# Altium schematic sheet disp7segTester.SchDoc: DE:TMP:11:UC:EXPANDIDO
size 386 x 254 mm; Date: 21-07-2022; SheetNumber: 1; SheetTotal: 1; WebFGR: www.abebashop.com; VersionFGR: 20220721; PageSetup: Record=PageOptions|CenterHorizontal=True|CenterVertical=True|PrintScale=0.74|XCorrection=1.00|YCorrection=1.00|PrintKind=0|BorderSize=5000000|LeftOffset=0|BottomOffset=0|Orientation=2|PaperLength=1000|PaperWidth=1000|Scale=100|PaperSource=7|PrintQuality=-4|MediaType=1|DitherType=10|PaperKind=Letter|PrintScaleMode=1
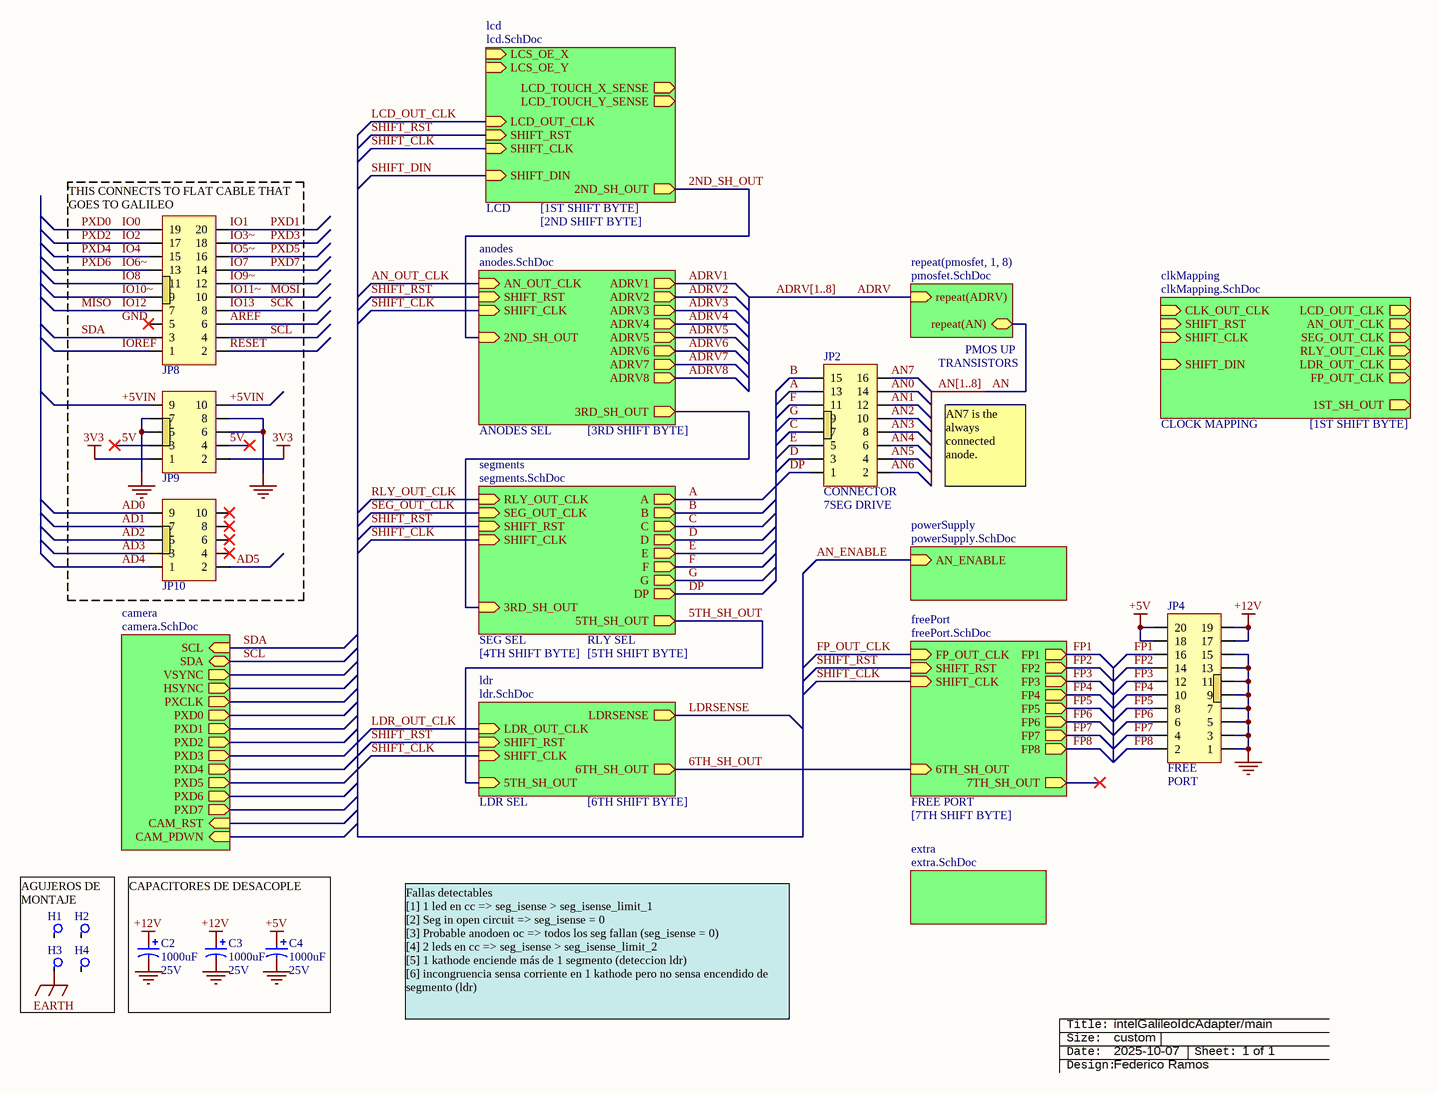
[diagram p0: disp7segTester.SchDoc]

## Parts
C2  value 1000uF  Voltaje: 25V  [C_EL_6-3X11]  (hidden comment: Cap Pol)
C3  value 1000uF  Voltaje: 25V  [C_EL_6-3X11]  (hidden comment: Cap Pol)
C4  value 1000uF  Voltaje: 25V  [C_EL_6-3X11]  (hidden comment: Cap Pol)
H1  Agujero de montaje  [agujero]  (value not drawn)
H2  Agujero de montaje  [agujero]  (value not drawn)
H3  Agujero de montaje  [agujero]  (value not drawn)
H4  Agujero de montaje  [agujero]  (value not drawn)
JP2  con: CONNECTOR  [idc8x2_90]  (hidden comment: IDC 8x2 90deg)
JP4  IDC 10x2  [idc10x2]  (value not drawn)
JP8  IDC 10x2 90deg  [idc10x2_90]  (value not drawn)
JP9  IDC 5x2  [IDC5x2_90]  (value not drawn)
JP10  IDC 5x2  [IDC5x2_90]  (value not drawn)
ROT?  Rotulo_empty  (value not drawn)  (graphical)

## Sub-sheets
anodes = anodes.SchDoc: 3RD_SH_OUT (out), AN_OUT_CLK (in), SHIFT_RST (in), SHIFT_CLK (in), 2ND_SH_OUT (in), ADRV1 (out), ADRV2 (out), ADRV3 (out), ADRV4 (out), ADRV5 (out), ADRV6 (out), ADRV7 (out), ADRV8 (out)  | : [3RD SHIFT BYTE]; : ANODES SEL
camera = camera.SchDoc: SCL (in), SDA (bidir), VSYNC (out), HSYNC (out), PXD0 (out), PXD1 (out), PXD2 (out), PXD3 (out), PXD4 (out), PXD5 (out), PXD6 (out), PXD7 (out), CAM_RST (in), CAM_PDWN (in), PXCLK (out)
clkMapping = clkMapping.SchDoc: 1ST_SH_OUT (out), CLK_OUT_CLK (in), SHIFT_RST (in), SHIFT_CLK (in), SHIFT_DIN (in), LCD_OUT_CLK (out), AN_OUT_CLK (out), SEG_OUT_CLK (out), RLY_OUT_CLK (out), LDR_OUT_CLK (out), FP_OUT_CLK (out)  | : [1ST SHIFT BYTE]; : CLOCK MAPPING
extra = extra.SchDoc: no entries
freePort = freePort.SchDoc: 7TH_SH_OUT (out), FP_OUT_CLK (in), SHIFT_RST (in), SHIFT_CLK (in), 6TH_SH_OUT (in), FP1 (out), FP2 (out), FP3 (out), FP4 (out), FP5 (out), FP6 (out), FP7 (out), FP8 (out)  | : [7TH SHIFT BYTE]; : FREE PORT
lcd = lcd.SchDoc: LCD_OUT_CLK (in), SHIFT_RST (in), SHIFT_CLK (in), SHIFT_DIN (in), 2ND_SH_OUT (out), LCS_OE_Y (in), LCS_OE_X (in), LCD_TOUCH_X_SENSE (out), LCD_TOUCH_Y_SENSE (out)  | : LCD; : [1ST SHIFT BYTE]; : [2ND SHIFT BYTE]
ldr = ldr.SchDoc: LDRSENSE (out), LDR_OUT_CLK (in), SHIFT_RST (in), SHIFT_CLK (in), 5TH_SH_OUT (in), 6TH_SH_OUT (out)  | : [6TH SHIFT BYTE]; : LDR SEL
powerSupply = powerSupply.SchDoc: AN_ENABLE (in)
repeat(pmosfet, 1, 8) = pmosfet.SchDoc: repeat(AN), repeat(ADRV) (in)  | : TRANSISTORS; : PMOS UP
segments = segments.SchDoc: 5TH_SH_OUT (out), RLY_OUT_CLK (in), SEG_OUT_CLK (in), SHIFT_RST (in), SHIFT_CLK (in), 3RD_SH_OUT (in), A (out), B (out), C (out), D (out), E (out), F (out), G (out), DP (out)  | : [5TH SHIFT BYTE]; : SEG SEL; : RLY SEL; : [4TH SHIFT BYTE]

## Nets
3V3: JP9.1 JP9.2
+5V: C4.1 JP4.18 JP4.20
+12V: C2.1 C3.1 JP4.17 JP4.19
EARTH: H3.1
GND: C2.2 C3.2 C4.2 JP4.1 JP4.3 JP4.5 JP4.7 JP4.9 JP4.11 JP4.13 JP4.15 JP9.5 JP9.6 JP9.7 JP9.8
2ND_SH_OUT: sheet anodes/2ND_SH_OUT, sheet lcd/2ND_SH_OUT
5TH_SH_OUT: sheet ldr/5TH_SH_OUT, sheet segments/5TH_SH_OUT
5V: JP9.3 JP9.4
6TH_SH_OUT: sheet ldr/6TH_SH_OUT, sheet freePort/6TH_SH_OUT
+5VIN: JP9.9 JP9.10
A: JP2.13 ; sheet segments/A
AD0: JP10.9
AD1: JP10.7
AD2: JP10.5
AD3: JP10.3
AD4: JP10.1
AD5: JP10.2
ADRV: sheet repeat(pmosfet, 1, 8)/repeat(ADRV)
ADRV1: sheet anodes/ADRV1
ADRV2: sheet anodes/ADRV2
ADRV3: sheet anodes/ADRV3
ADRV4: sheet anodes/ADRV4
ADRV5: sheet anodes/ADRV5
ADRV6: sheet anodes/ADRV6
ADRV7: sheet anodes/ADRV7
ADRV8: sheet anodes/ADRV8
AN: sheet repeat(pmosfet, 1, 8)/repeat(AN)
AN0: JP2.14
AN1: JP2.12
AN2: JP2.10
AN3: JP2.8
AN4: JP2.6
AN5: JP2.4
AN6: JP2.2
AN7: JP2.16
AN_ENABLE: sheet powerSupply/AN_ENABLE
AN_OUT_CLK: sheet anodes/AN_OUT_CLK
AREF: JP8.6
B: JP2.15 ; sheet segments/B
C: JP2.7 ; sheet segments/C
D: JP2.3 ; sheet segments/D
DP: JP2.1 ; sheet segments/DP
E: JP2.5 ; sheet segments/E
F: JP2.11 ; sheet segments/F
FP1: JP4.16 ; sheet freePort/FP1
FP2: JP4.14 ; sheet freePort/FP2
FP3: JP4.12 ; sheet freePort/FP3
FP4: JP4.10 ; sheet freePort/FP4
FP5: JP4.8 ; sheet freePort/FP5
FP6: JP4.6 ; sheet freePort/FP6
FP7: JP4.4 ; sheet freePort/FP7
FP8: JP4.2 ; sheet freePort/FP8
FP_OUT_CLK: sheet freePort/FP_OUT_CLK
G: JP2.9 ; sheet segments/G
IO0: JP8.19  [also labelled PXD0]
IO1: JP8.20  [also labelled PXD1]
IO2: JP8.17  [also labelled PXD2]
IO3~: JP8.18  [also labelled PXD3]
IO4: JP8.15  [also labelled PXD4]
IO5~: JP8.16  [also labelled PXD5]
IO6~: JP8.13  [also labelled PXD6]
IO7: JP8.14  [also labelled PXD7]
IO8: JP8.11
IO9~: JP8.12
IO10~: JP8.9
IO11~: JP8.10  [also labelled MOSI]
IO12: JP8.7  [also labelled MISO]
IO13: JP8.8  [also labelled SCK]
IOREF: JP8.1
LCD_OUT_CLK: sheet lcd/LCD_OUT_CLK
LDR_OUT_CLK: sheet ldr/LDR_OUT_CLK
LDRSENSE: sheet ldr/LDRSENSE
RESET: JP8.2
RLY_OUT_CLK: sheet segments/RLY_OUT_CLK
SCL: JP8.4 ; sheet camera/SDA
SDA: JP8.3 ; sheet camera/SCL
SEG_OUT_CLK: sheet segments/SEG_OUT_CLK
SHIFT_CLK: sheet ldr/SHIFT_CLK, sheet segments/SHIFT_CLK, sheet anodes/SHIFT_CLK, sheet freePort/SHIFT_CLK, sheet lcd/SHIFT_CLK
SHIFT_DIN: sheet lcd/SHIFT_DIN
SHIFT_RST: sheet ldr/SHIFT_RST, sheet segments/SHIFT_RST, sheet anodes/SHIFT_RST, sheet freePort/SHIFT_RST, sheet lcd/SHIFT_RST
(unnamed): sheet segments/3RD_SH_OUT, sheet anodes/3RD_SH_OUT

Not connected (* = marked no-connect by the designer): H1 1; H2 1; H4 1; JP8 5*; JP10 4* 6* 8* 10*

## Buses and harness runs
bus ADRV[1..8]
bus AN[1..8]

## Notes on the sheet
- (near JP8) THIS CONNECTS TO FLAT CABLE THAT GOES TO GALILEO
- AN7 is the always connected anode.
- AGUJEROS DE MONTAJE
- CAPACITORES DE DESACOPLE
- Fallas detectables
  [1] 1 led en cc => seg_isense > seg_isense_limit_1
  [2] Seg in open circuit => seg_isense = 0
  [3] Probable anodoen oc => todos los seg fallan (seg_isense = 0)
  [4] 2 leds en cc => seg_isense > seg_isense_limit_2
  [5] 1 kathode enciende más de 1 segmento (deteccion ldr)
  [6] incongruencia sensa corriente en 1 kathode pero no sensa encendido de segmento (ldr)
- intelGalileoIdcAdapter/main
- custom
- 2025-10-07
- (near ROT?) 1 of 1
- Federico Ramos
- Labels drawn without touching a wire or pin: GND
- (in symbol IDC 8x2 90deg) 7SEG DRIVE
- (in symbol IDC 10x2) FREE; PORT
- (in symbol Rotulo_empty) Title:; Size:; Date:; Sheet:; Design:

## Library data of the parts
C2-C4 = Cap Pol: Capacitor Electrolítico; Price: ?
JP2 = IDC 8x2 90deg: outout: OUTPUT; drv: DRIVE; Price: ?
ROT? = Rotulo_empty: Rotulo [consolas]
JP4 = IDC 10x2: Price: ?
JP8 = IDC 10x2 90deg: Price: ?
JP9 JP10 = IDC 5x2: Price: ?